# Altium schematic sheet Multiply_2.SchDoc
size A; SheetNumber: 8; SheetTotal: 8
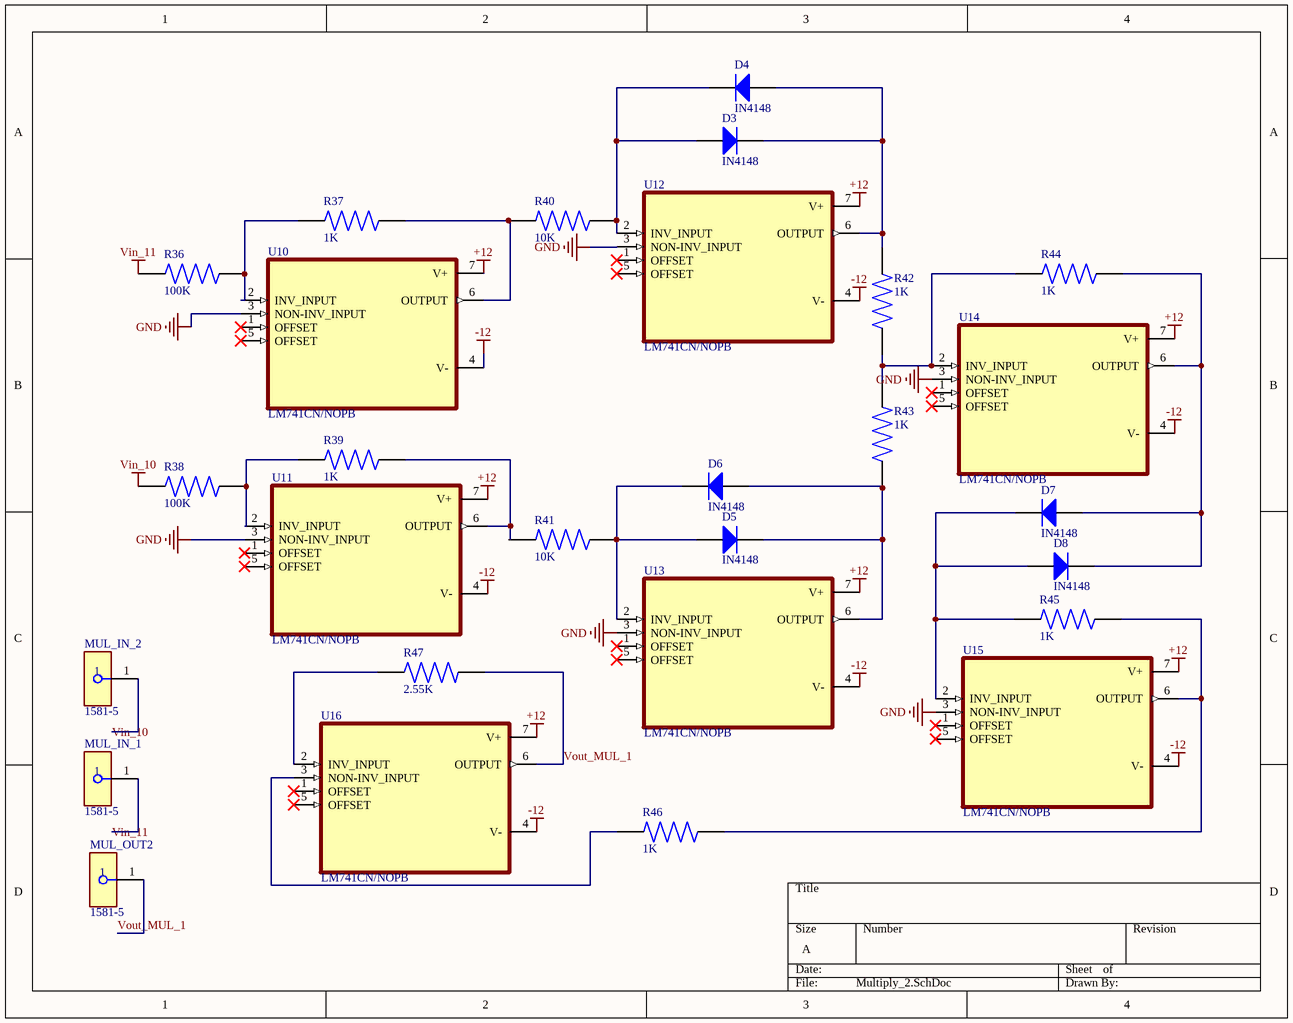
[diagram p0: Multiply_2.SchDoc]

## Parts
D3  IN4148  [PCBComponent_1]
D4  IN4148  [PCBComponent_1]
D5  IN4148  [PCBComponent_1]
D6  IN4148  [PCBComponent_1]
D7  IN4148  [PCBComponent_1]
D8  IN4148  [PCBComponent_1]
MUL_IN_1  1581-5  [FP-1581-5-MFG]
MUL_IN_2  1581-5  [FP-1581-5-MFG]
MUL_OUT2  1581-5  [FP-1581-5-MFG]
R36  100K  [RESAD1100W55L680D260]
R37  1K  [RESAD1100W55L680D260]
R38  100K  [RESAD1100W55L680D260]
R39  1K  [RESAD1100W55L680D260]
R40  10K  [RESAD1100W55L680D260]
R41  10K  [RESAD1100W55L680D260]
R42  1K  [RESAD1100W55L680D260]
R43  1K  [RESAD1100W55L680D260]
R44  1K  [RESAD1100W55L680D260]
R45  1K  [RESAD1100W55L680D260]
R46  1K  [RESAD1100W55L680D260]
R47  2.55K  [RESAD1100W55L680D260]
U10  LM741CN/NOPB  [DIP794W45P254L959H508Q8]
U11  LM741CN/NOPB  [DIP794W45P254L959H508Q8]
U12  LM741CN/NOPB  [DIP794W45P254L959H508Q8]
U13  LM741CN/NOPB  [DIP794W45P254L959H508Q8]
U14  LM741CN/NOPB  [DIP794W45P254L959H508Q8]
U15  LM741CN/NOPB  [DIP794W45P254L959H508Q8]
U16  LM741CN/NOPB  [DIP794W45P254L959H508Q8]

## Nets
+12: U10.7(V+) U11.7(V+) U12.7(V+) U13.7(V+) U14.7(V+) U15.7(V+) U16.7(V+)
-12: U10.4(V-) U11.4(V-) U12.4(V-) U13.4(V-) U14.4(V-) U15.4(V-) U16.4(V-)
GND: U10.3(NON-INV_INPUT) U11.3(NON-INV_INPUT) U12.3(NON-INV_INPUT) U13.3(NON-INV_INPUT) U14.3(NON-INV_INPUT) U15.3(NON-INV_INPUT)
Vin_10: MUL_IN_2.1 R38.1
Vin_11: MUL_IN_1.1 R36.1
Vout_MUL_1: MUL_OUT2.1 R47.2 U16.6(OUTPUT)
NetD3_1: D3.1(K) D4.2(A) R42.1 U12.6(OUTPUT)
NetD3_2: D3.2(A) D4.1(K) R40.2 U12.2(INV_INPUT)
NetD5_1: D5.1(K) D6.2(A) R43.1 U13.6(OUTPUT)
NetD5_2: D5.2(A) D6.1(K) R41.2 U13.2(INV_INPUT)
NetD7_1: D7.1(K) D8.2(A) R45.1 U15.2(INV_INPUT)
NetD7_2: D7.2(A) D8.1(K) R44.2 U14.6(OUTPUT)
NetR36_2: R36.2 R37.1 U10.2(INV_INPUT)
NetR37_2: R37.2 R40.1 U10.6(OUTPUT)
NetR38_2: R38.2 R39.1 U11.2(INV_INPUT)
NetR39_2: R39.2 U11.6(OUTPUT)
NetR42_2: R42.2 R43.2 R44.1 U14.2(INV_INPUT)
NetR45_2: R45.2 R46.2 U15.6(OUTPUT)
NetR46_1: R46.1 U16.3(NON-INV_INPUT)
NetR47_1: R47.1 U16.2(INV_INPUT)

Not connected (* = marked no-connect by the designer): R41 1; U10 1(OFFSET)* 5(OFFSET)*; U11 1(OFFSET)* 5(OFFSET)*; U12 1(OFFSET)* 5(OFFSET)*; U13 1(OFFSET)* 5(OFFSET)*; U14 1(OFFSET)* 5(OFFSET)*; U15 1(OFFSET)* 5(OFFSET)*; U16 1(OFFSET)* 5(OFFSET)*

## Library data of the parts
D3-D8 = Component_1
MUL_IN_1 MUL_IN_2 MUL_OUT2 = CMP-73906-000011-1: CONN BANANA JACK TURRET GREEN; Body Material: PC; Number of Contacts: 1; Max Current Rating: 15A; Voltage Rating (AC): 30V; Insulation: Mating End Insulated; Voltage Rating: 2.5kV; Voltage Rating (DC): 60V; Gender: Female; Height: 0.25inch; Mount: Panel; RoHS Compliant: Yes; Length: 1.22inch; Orientation: Straight; Diameter: 4.22mm; Lead Free: Lead Free; Package Quantity: 1; Termination: Turret; Current Rating: 15A; Packaging: Bag; Series: 1581; REACH SVHC: No SVHC; Number of Positions: 1; Contact Plating: Tin; Housing Color: Green; Contact Material: Brass; Insulation Material: Polycarbonate; Weight: 0.126lb; Number of Ports: 1; Color: Green; Housing Material: Polycarbonate; Width: 4inch
R36-R47 = MFR-25FBF52-1K: 1.07 kOhms Â±1% 0.25W, 1/4W Through Hole Resistor Axial - Metal Film; MF: Yageo; SnapEDA_Link: https://www.snapeda.com/parts/MFR-25FBF52-1K/Yageo/view-part/?ref=snap; Package: RADIAL-2 YAGEO; Value: *; MP: MFR-25FBF52-1K; Check_prices: https://www.snapeda.com/parts/MFR-25FBF52-1K/Yageo/view-part/?ref=eda
U10-U16 = LM741CN/NOPB: Single, 44-V, 1-MHz operational amplifier; MF: Texas Instruments; SnapEDA_Link: https://www.snapeda.com/parts/LM741CN/NOPB/Texas+Instruments/view-part/?ref=snap; Package: PDIP-8 Texas; Value: *; MP: LM741CN/NOPB; Check_prices: https://www.snapeda.com/parts/LM741CN/NOPB/Texas+Instruments/view-part/?ref=eda